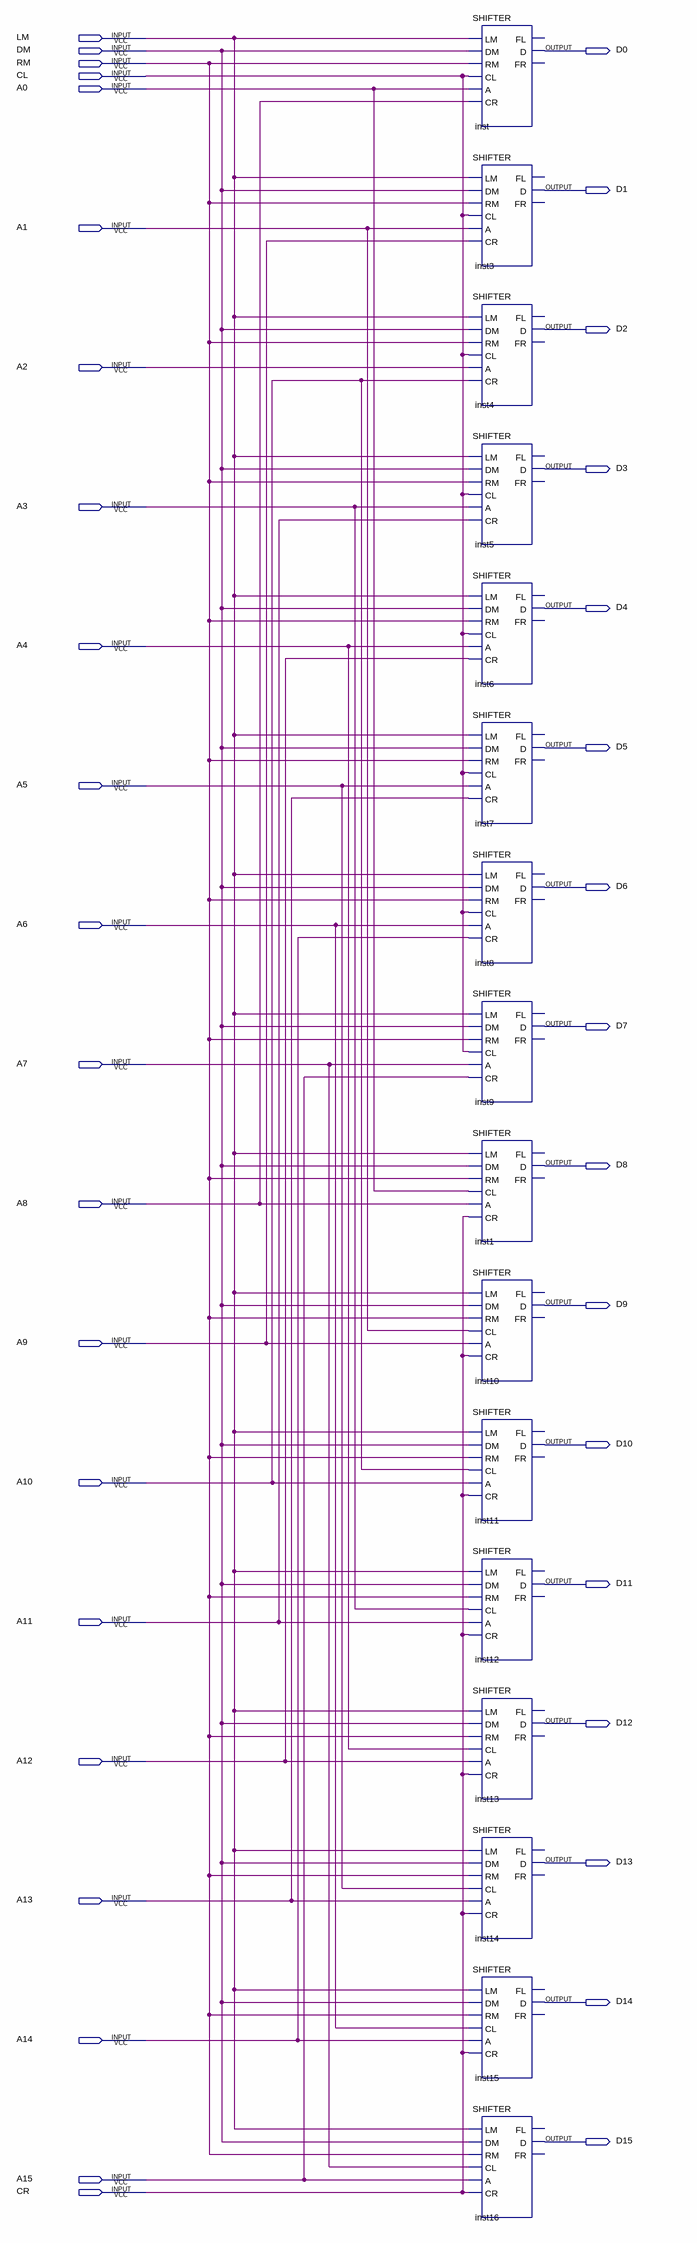
[diagram p0: schematic sheet]
// Quartus schematic SHIFTER16-8s.bdf as structural Verilog: 16 symbols, 37 pins
module \SHIFTER16-8s  (
  input  LM,
  input  DM,
  input  RM,
  input  CL,
  input  A0,
  input  A1,
  input  A2,
  input  A3,
  input  A4,
  input  A5,
  input  A6,
  input  A7,
  input  A8,
  input  A9,
  input  A10,
  input  A11,
  input  A12,
  input  A13,
  input  A14,
  input  A15,
  input  CR,
  output D0,
  output D1,
  output D2,
  output D3,
  output D4,
  output D5,
  output D6,
  output D7,
  output D8,
  output D9,
  output D10,
  output D11,
  output D12,
  output D13,
  output D14,
  output D15
);

  SHIFTER inst (.LM(LM), .DM(DM), .RM(RM), .CL(CL), .A(A0), .CR(A8), .D(D0));  // open: FL, FR
  SHIFTER inst3 (.LM(LM), .DM(DM), .RM(RM), .CL(CL), .A(A1), .CR(A9), .D(D1));  // open: FL, FR
  SHIFTER inst4 (.LM(LM), .DM(DM), .RM(RM), .CL(CL), .A(A2), .CR(A10), .D(D2));  // open: FL, FR
  SHIFTER inst5 (.LM(LM), .DM(DM), .RM(RM), .CL(CL), .A(A3), .CR(A11), .D(D3));  // open: FL, FR
  SHIFTER inst6 (.LM(LM), .DM(DM), .RM(RM), .CL(CL), .A(A4), .CR(A12), .D(D4));  // open: FL, FR
  SHIFTER inst7 (.LM(LM), .DM(DM), .RM(RM), .CL(CL), .A(A5), .CR(A13), .D(D5));  // open: FL, FR
  SHIFTER inst8 (.LM(LM), .DM(DM), .RM(RM), .CL(CL), .A(A6), .CR(A14), .D(D6));  // open: FL, FR
  SHIFTER inst9 (.LM(LM), .DM(DM), .RM(RM), .CL(CL), .A(A7), .CR(A15), .D(D7));  // open: FL, FR
  SHIFTER inst1 (.LM(LM), .DM(DM), .RM(RM), .CL(A0), .A(A8), .CR(CR), .D(D8));  // open: FL, FR
  SHIFTER inst10 (.LM(LM), .DM(DM), .RM(RM), .CL(A1), .A(A9), .CR(CR), .D(D9));  // open: FL, FR
  SHIFTER inst11 (.LM(LM), .DM(DM), .RM(RM), .CL(A10), .A(A10), .CR(CR), .D(D10));  // open: FL, FR
  SHIFTER inst12 (.LM(LM), .DM(DM), .RM(RM), .CL(A3), .A(A11), .CR(CR), .D(D11));  // open: FL, FR
  SHIFTER inst13 (.LM(LM), .DM(DM), .RM(RM), .CL(A4), .A(A12), .CR(CR), .D(D12));  // open: FL, FR
  SHIFTER inst14 (.LM(LM), .DM(DM), .RM(RM), .CL(A5), .A(A13), .CR(CR), .D(D13));  // open: FL, FR
  SHIFTER inst15 (.LM(LM), .DM(DM), .RM(RM), .CL(A6), .A(A14), .CR(CR), .D(D14));  // open: FL, FR
  SHIFTER inst16 (.LM(LM), .DM(DM), .RM(RM), .CL(A7), .A(A15), .CR(CR), .D(D15));  // open: FL, FR
endmodule
